# EAGLE design CrowPanel ESP32 Display-3.5-V2.2-20240704 (EAGLE 9.5.1)
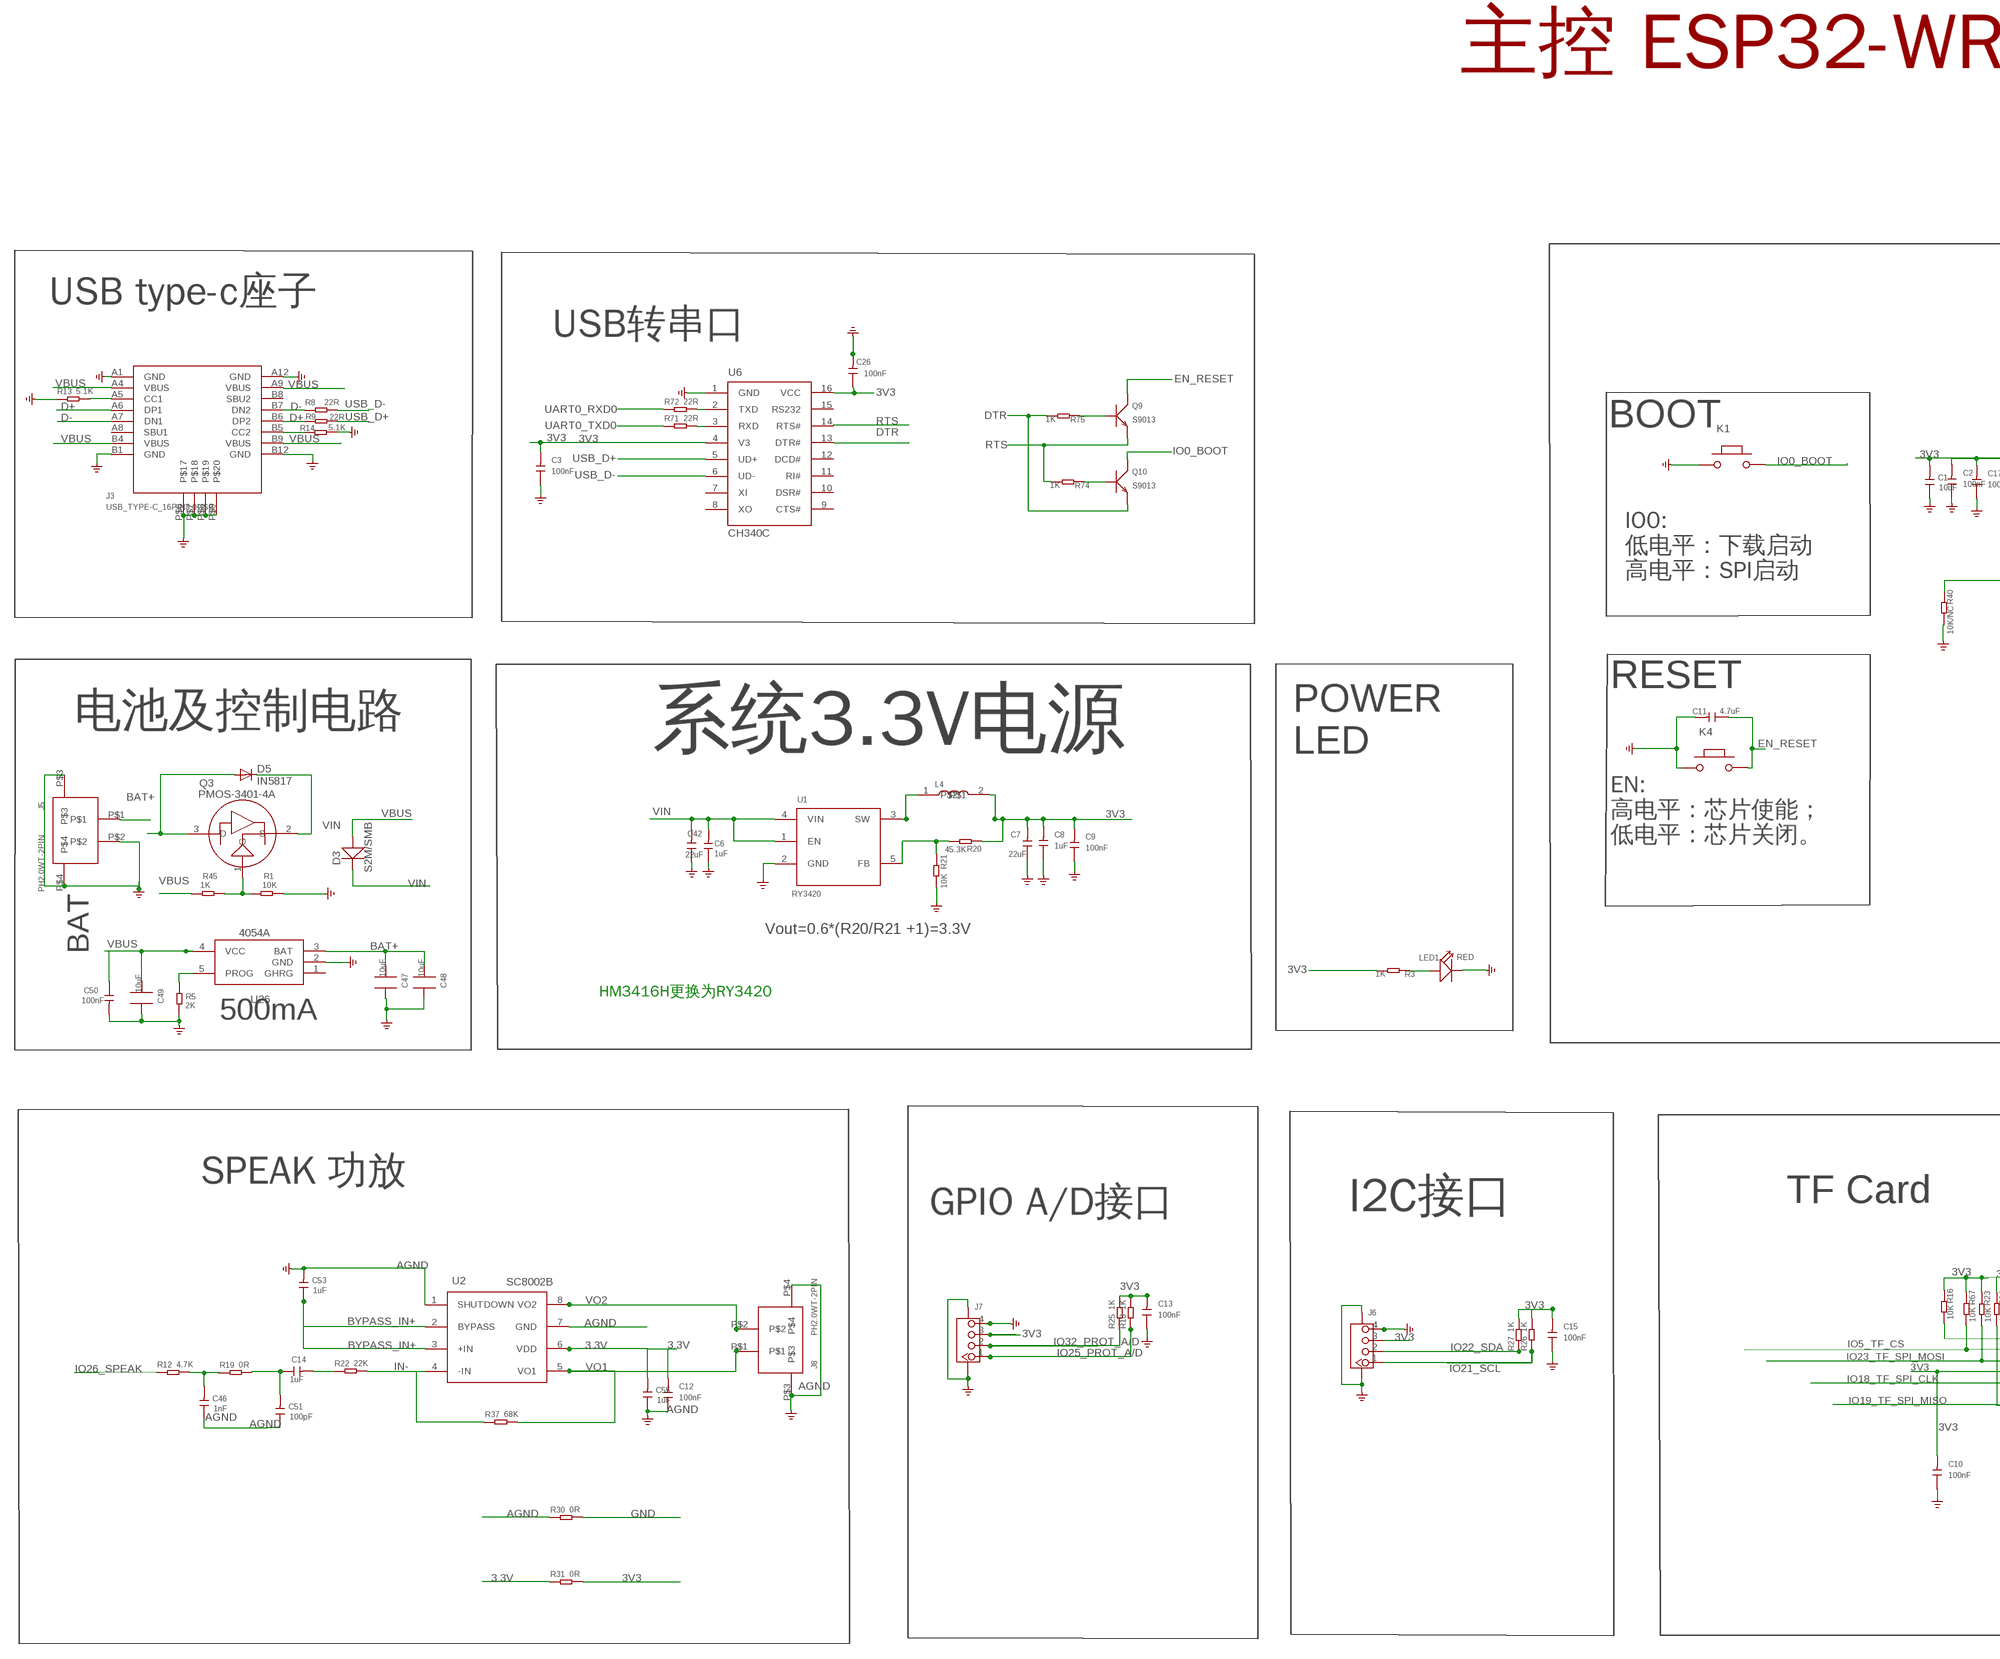
[diagram p0: schematic, sheet 1, part 1 of 2]
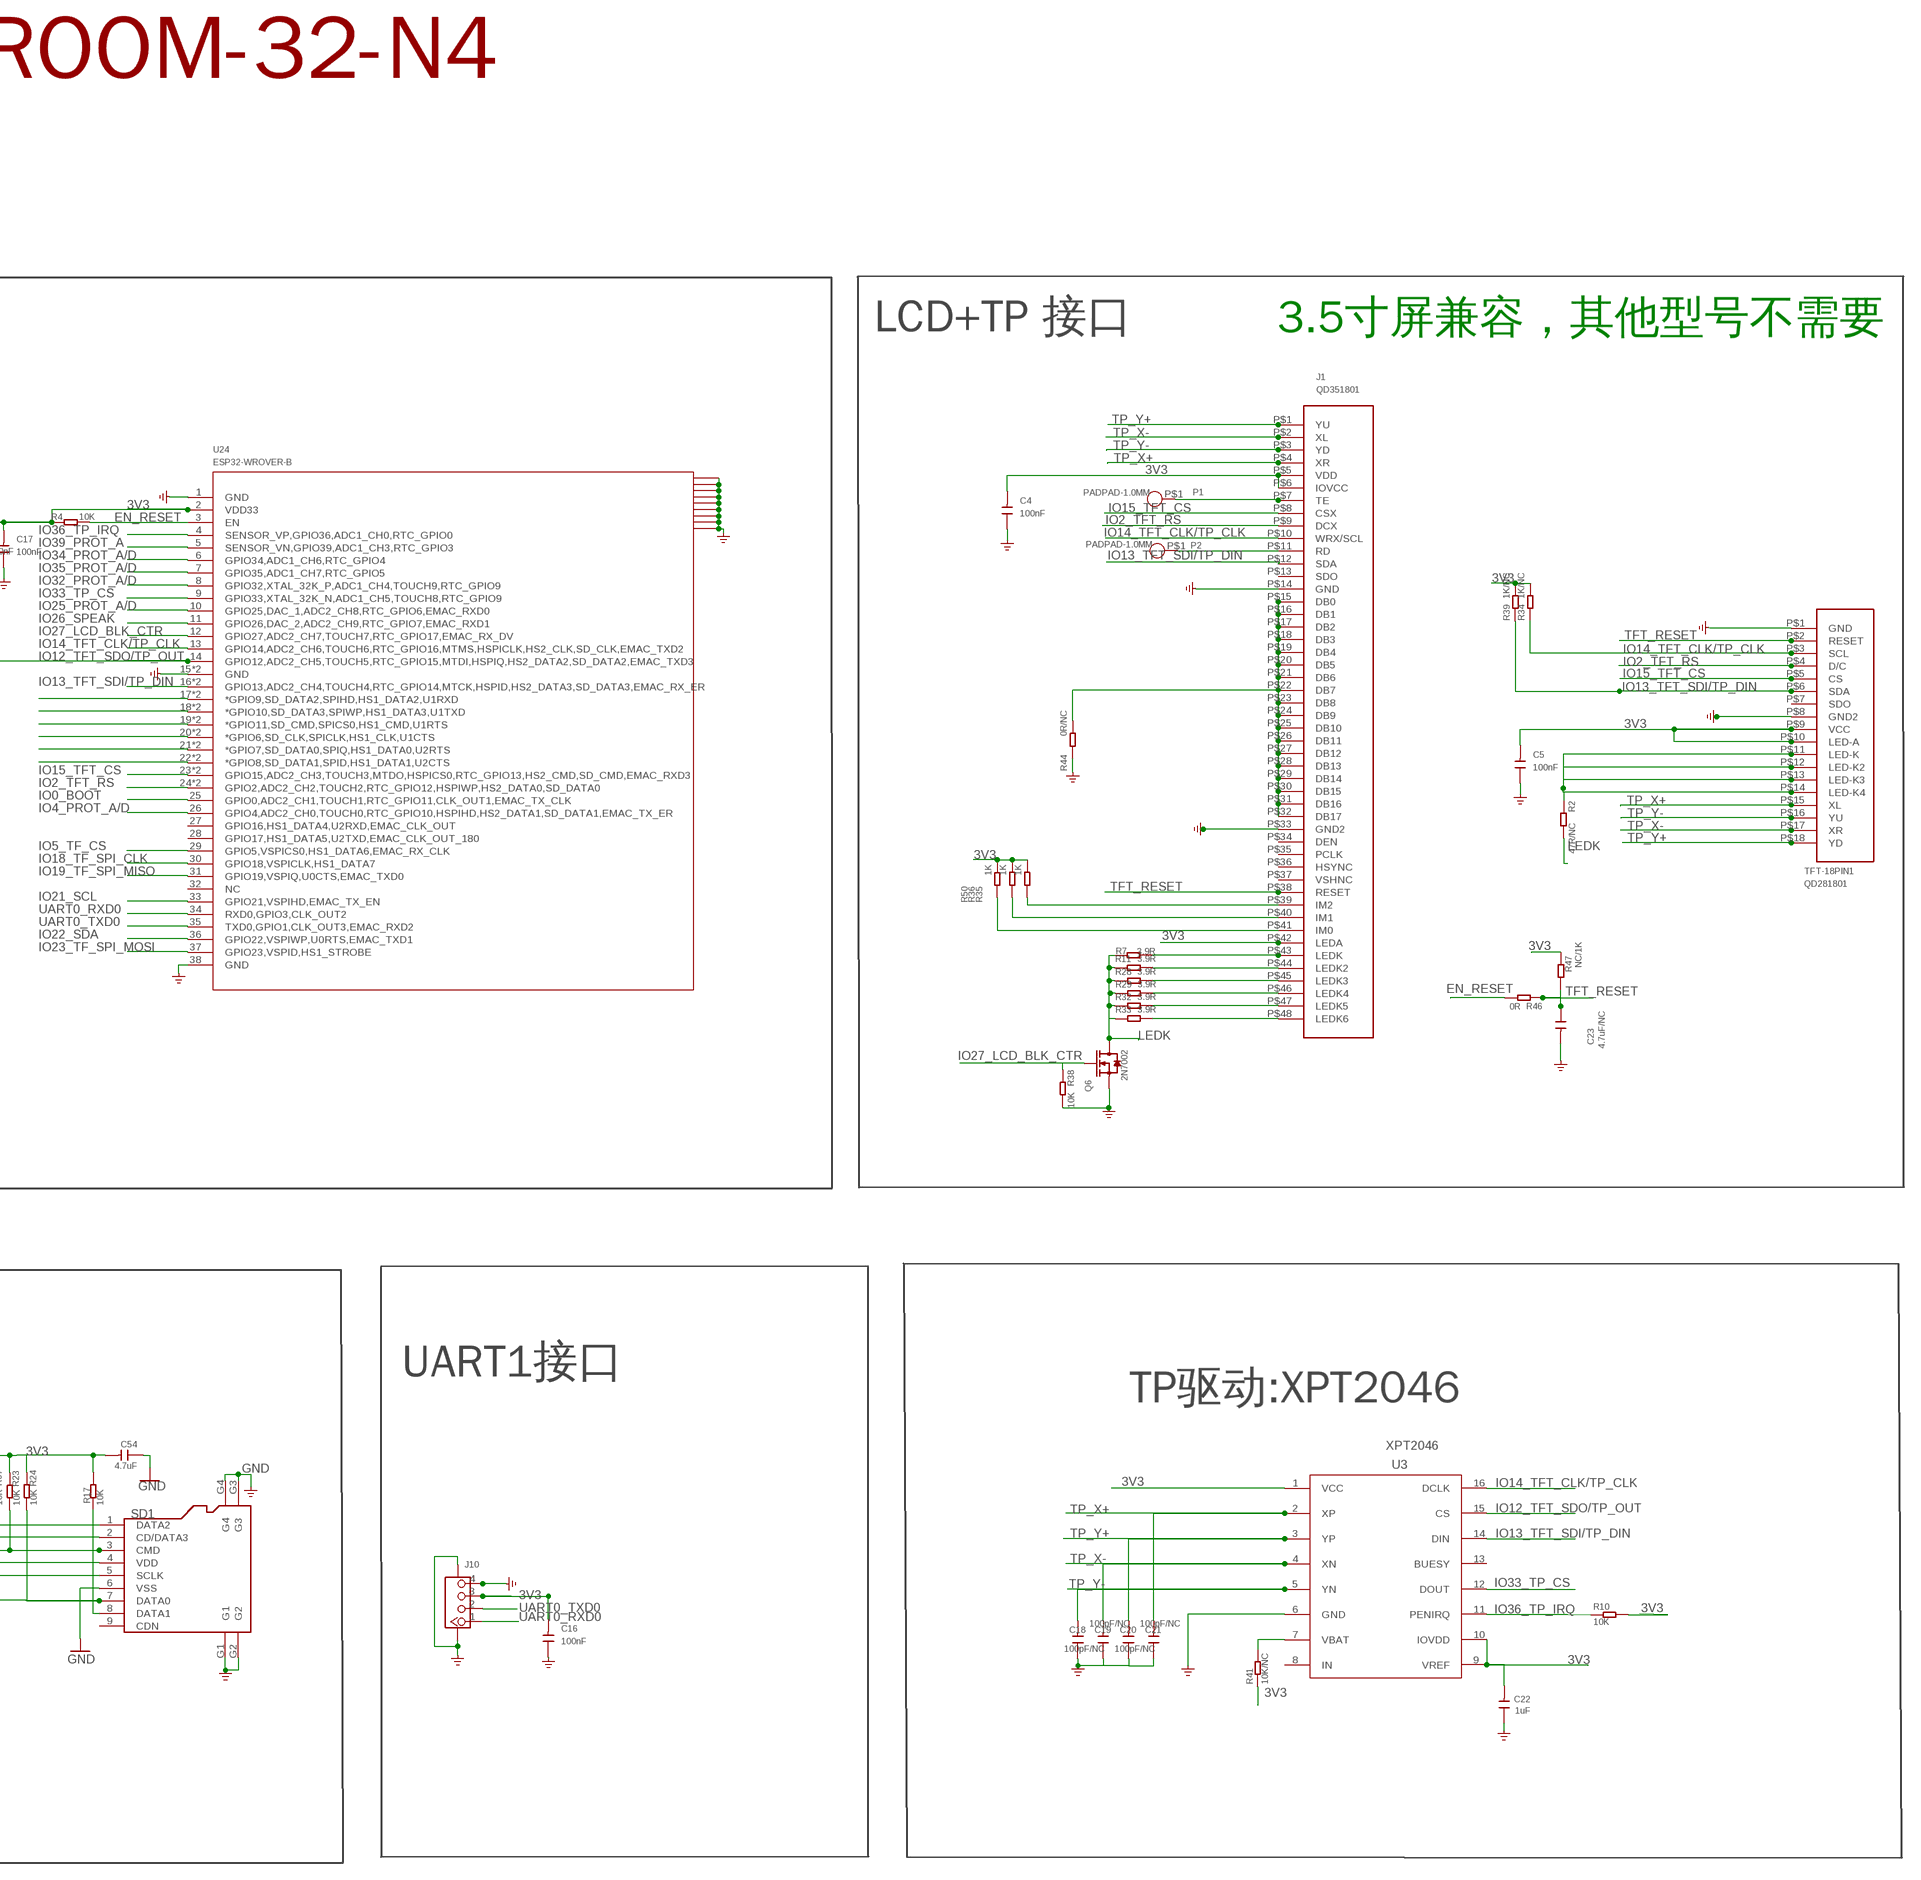
[diagram p1: schematic, sheet 1, part 2 of 2]

## Parts
C1  10uF  DISCRETE_C-0603  [DISCRETE_C0603]
C2  100nF  C0603  [0603]
C3  100nF  C0603  [0603]
C4  100nF  C0603  [0603]
C5  100nF  C0603  [0603]
C6  1uF  C0603  [0603]
C7  22uF  C0805  [0805]
C8  1uF  C0603  [0603]
C9  100nF  C0603  [0603]
C10  100nF  C0603  [0603]
C11  4.7uF  C0603  [0603]
C12  100nF  C0603  [0603]
C13  100nF  C0603  [0603]
C14  1uF  DISCRETE_C-0603  [DISCRETE_C0603]
C15  100nF  C0603  [0603]
C16  100nF  C0603  [0603]
C17  100nF  C0603  [0603]
C18  100pF/NC  C0603  [0603]
C19  100pF/NC  C0603  [0603]
C20  100pF/NC  C0603  [0603]
C21  100pF/NC  C0603  [0603]
C22  1uF  DISCRETE_C-0603  [DISCRETE_C0603]
C23  4.7uF/NC  C0603  [0603]
C26  100nF  C0603  [0603]
C42  22uF  C0805  [0805]
C46  1nF  DISCRETE_C-0603  [DISCRETE_C0603]
C47  10uF  C0805_S  [0805_S]
C48  10uF  C0805_S  [0805_S]
C49  10uF  C0805_S  [0805_S]
C50  100nF  C-0603  [C0603]
C51  100pF  DISCRETE_C-0603  [DISCRETE_C0603]
C53  1uF  DISCRETE_C-0603  [DISCRETE_C0603]
C54  4.7uF  DISCRETE_C-0603  [DISCRETE_C0603]
C55  1uF  DISCRETE_C-0603  [DISCRETE_C0603]
D3  S2M/SMB  214ABDO-214AB  [214AB]
D5  IN5817  DIODE-DO-214AC  [DO-214AC]
J1  QD351801  [QD351801-0.8MM*48]
J3  USB_TYPE-C_16PIN3.0USB  [KEVIN_3.0TYPEC-SMD]
J5  PH2.0WT-2PIN  [PH2.0WT-2PIN]
J6  CONNECTOR_TWIG-4P-2.0-SMD-FEMALE-REINFORCE90D  [CONNECTOR_4P-SMD-2.0-90D]
J7  CONNECTOR_TWIG-4P-2.0-SMD-FEMALE-REINFORCE90D  [CONNECTOR_4P-SMD-2.0-90D]
J8  PH2.0WT-2PIN  [PH2.0WT-2PIN]
J10  CONNECTOR_TWIG-4P-2.0-SMD-FEMALE-REINFORCE90D  [CONNECTOR_4P-SMD-2.0-90D]
K1  BUTTON  PB157  [157SW]
K4  BUTTON  PB157  [157SW]
L4  L-0530  [CD54_CD54]
LED1  RED  DISCRETE_LED0603  [DISCRETE_LED-0603]
P1  PADPAD-1.0MM  [PAD-1.0MM]
P2  PADPAD-1.0MM  [PAD-1.0MM]
Q3  PMOS-3401-4A  P-MOS-SOT23  [SOT-23]
Q6  2N7002  MOSFET-N'SOT23'  [SOT23]
Q9  S9013  TRANSISTOR-NPN-SOT23  [SOT23@1]
Q10  S9013  TRANSISTOR-NPN-SOT23  [SOT23@1]
R1  10K  DISCRETE_R-0603  [DISCRETE_R0603]
R2  47R/NC  DISCRETE_R-0603  [DISCRETE_R0603]
R3  1K  DISCRETE_R-0603  [DISCRETE_R0603]
R4  10K  R0603  [R0603]
R5  2K  DISCRETE_R-0603  [DISCRETE_R0603]
R7  3.9R  DISCRETE_R-0603  [DISCRETE_R0603]
R8  22R  DISCRETE_R-0603  [DISCRETE_R0603]
R9  22R  DISCRETE_R-0603  [DISCRETE_R0603]
R10  10K  DISCRETE_R-0603  [DISCRETE_R0603]
R11  3.9R  DISCRETE_R-0603  [DISCRETE_R0603]
R12  4.7K  DISCRETE_R-0603  [DISCRETE_R0603]
R13  5.1K  DISCRETE_R-0603  [DISCRETE_R0603]
R14  5.1K  DISCRETE_R-0603  [DISCRETE_R0603]
R16  10K  DISCRETE_R-0603  [DISCRETE_R0603]
R17  10K  DISCRETE_R-0603  [DISCRETE_R0603]
R18  1K  DISCRETE_R-0603  [DISCRETE_R0603]
R19  0R  DISCRETE_R-0603  [DISCRETE_R0603]
R20  45.3K  DISCRETE_R-0603  [DISCRETE_R0603]
R21  10K  DISCRETE_R-0603  [DISCRETE_R0603]
R22  22K  DISCRETE_R-0603  [DISCRETE_R0603]
R23  10K  DISCRETE_R-0603  [DISCRETE_R0603]
R24  10K  DISCRETE_R-0603  [DISCRETE_R0603]
R25  1K  DISCRETE_R-0603  [DISCRETE_R0603]
R26  1K  DISCRETE_R-0603  [DISCRETE_R0603]
R27  1K  DISCRETE_R-0603  [DISCRETE_R0603]
R28  3.9R  DISCRETE_R-0603  [DISCRETE_R0603]
R29  3.9R  DISCRETE_R-0603  [DISCRETE_R0603]
R30  0R  DISCRETE_R-0603  [DISCRETE_R0603]
R31  0R  DISCRETE_R-0603  [DISCRETE_R0603]
R32  3.9R  DISCRETE_R-0603  [DISCRETE_R0603]
R33  3.9R  DISCRETE_R-0603  [DISCRETE_R0603]
R34  1K/NC  DISCRETE_R-0603  [DISCRETE_R0603]
R35  1K  DISCRETE_R-0603  [DISCRETE_R0603]
R36  1K  DISCRETE_R-0603  [DISCRETE_R0603]
R37  68K  DISCRETE_R-0603  [DISCRETE_R0603]
R38  10K  DISCRETE_R-0603  [DISCRETE_R0603]
R39  1K/NC  DISCRETE_R-0603  [DISCRETE_R0603]
R40  10K/NC  DISCRETE_R-0603  [DISCRETE_R0603]
R41  10K/NC  DISCRETE_R-0603  [DISCRETE_R0603]
R44  0R/NC  DISCRETE_R-0603  [DISCRETE_R0603]
R45  1K  DISCRETE_R-0603  [DISCRETE_R0603]
R46  0R  DISCRETE_R-0603  [DISCRETE_R0603]
R47  NC/1K  DISCRETE_R-0603  [DISCRETE_R0603]
R50  1K  DISCRETE_R-0603  [DISCRETE_R0603]
R67  10K  DISCRETE_R-0603  [DISCRETE_R0603]
R71  22R  DISCRETE_R-0603  [DISCRETE_R0603]
R72  22R  DISCRETE_R-0603  [DISCRETE_R0603]
R74  1K  DISCRETE_R-0603  [DISCRETE_R0603]
R75  1K  DISCRETE_R-0603  [DISCRETE_R0603]
SD1  HOLDER-MICROSD-9P  [9P-SMD-W/-RING]
TFT-18PIN1  QD281801  [QD241801-18PIN*0.8]
U1  RY3420  A_XBJ_HM3420B  [A_XBJ_SOT23-5]
U2  SC8002B  SC8002BSC8002B-SOP8  [AT24C02_SOP8]
U3  XP2046  [XP2046-SSOP16]
U6  CH340C  CH340G  [SOP-16]
U24  ESP32-WROVER-B  ESP32-WROOM-32-N4  [ESP32-WROOM-32-N4]
U26  4054A  [SOP23-5]

## Nets
3.3V: C12.2 C55.2 R31.1 U2.6(VDD)
3V3: C1.2 C2.2 C3.2 C4.2 C5.2 C7.2 C8.2 C9.2 C10.2 C13.2 C15.2 C16.2 C17.2 C22.2 C26.1 C54.2 J1.P$5(VDD) J1.P$6(IOVCC) J1.P$42(LEDA) J6.3 J7.3 J10.3 L4.2 R3.2 R4.1 R10.2 R16.1 R17.1 R18.2 R20.1 R23.1 R24.1 R25.2 R26.2 R27.2 R31.2 R34.2 R35.2 R36.2 R39.2 R41.1 R47.2 R50.2 R67.1 SD1.4(VDD) TFT-18PIN1.P$9(VCC) TFT-18PIN1.P$10(LED-A) U3.1(VCC) U3.9(VREF) U3.10(IOVDD) U6.4(V3) U6.16(VCC) U24.2(VDD33)
AGND: C12.1 C46.1 C51.1 C53.2 C55.1 J8.P$3 J8.P$4 R30.1 U2.1(SHUTDOWN) U2.7(GND) ; supply symbol labelled GND
BAT+: C47.2 C48.2 D5.A J5.P$1 Q3.3(D) U26.3(BAT)
BYPASS_IN+: C53.1 U2.2(BYPASS) U2.3(+IN)
D+: J3.A6(DP1) J3.B6(DP2) R9.1
D-: J3.A7(DN1) J3.B7(DN2) R8.1
DTR: Q10.2(E) R75.2 U6.13(DTR#)
EN_RESET: C11.1 K4.2 Q9.3(C) R4.2 R46.2 U24.3(EN)
GND: C1.1 C2.1 C3.1 C4.1 C5.1 C6.1 C7.1 C8.1 C9.1 C10.1 C11.2 C13.1 C15.1 C16.1 C17.1 C18.1 C19.1 C20.1 C21.1 C22.1 C23.2 C26.2 C42.1 C47.1 C48.1 C49.1 C50.2 C54.1 J1.P$14(GND) J1.P$33(GND2) J3.A1(GND) J3.A12(GND) J3.B1(GND) J3.B12(GND) J3.P$6 J3.P$7 J3.P$8 J3.P$9 J5.P$2 J5.P$3 J5.P$4 J6.4 J6.SS1 J6.SS2 J7.4 J7.SS1 J7.SS2 J10.4 J10.SS1 J10.SS2 K1.1 K4.1 LED1.- Q6.2(S) R1.1 R5.2 R13.1 R14.2 R21.2 R30.2 R38.2 R40.2 R44.1 SD1.6(VSS) SD1.G1 SD1.G2 SD1.G3 SD1.G4 TFT-18PIN1.P$1(GND) TFT-18PIN1.P$8(GND2) U1.2(GND) U3.6(GND) U6.1(GND) U24.1(GND) U24.15(GND) U24.15@1(GND) U24.38(GND) U24.41(GND) U24.42(GND) U24.43(GND) U24.44(GND) U24.45(GND) U24.46(GND) U24.47(GND) U24.48(GND) U24.49(GND) U26.2(GND)
IN-: R22.2 R37.1 U2.4(-IN)
IO0_BOOT: K1.2 Q10.3(C) U24.25(GPIO0,ADC2_CH1,TOUCH1,RTC_GPIO11,CLK_OUT1,EMAC_TX_CLK)
IO2_TFT_RS: J1.P$9(DCX) TFT-18PIN1.P$4(D/C) U24.24(GPIO2,ADC2_CH2,TOUCH2,RTC_GPIO12,HSPIWP,HS2_DATA0,SD_DATA0) U24.24@1(GPIO2,ADC2_CH2,TOUCH2,RTC_GPIO12,HSPIWP,HS2_DATA0,SD_DATA0)
IO4_PROT_A/D: U24.26(GPIO4,ADC2_CH0,TOUCH0,RTC_GPIO10,HSPIHD,HS2_DATA1,SD_DATA1,EMAC_TX_ER)
IO5_TF_CS: R67.2 SD1.2(CD/DATA3) U24.29(GPIO5,VSPICS0,HS1_DATA6,EMAC_RX_CLK)
IO12_TFT_SDO/TP_OUT: R40.1 U3.15(CS) U24.14(GPIO12,ADC2_CH5,TOUCH5,RTC_GPIO15,MTDI,HSPIQ,HS2_DATA2,SD_DATA2,EMAC_TXD3)
IO13_TFT_SDI/TP_DIN: J1.P$12(SDA) R39.1 TFT-18PIN1.P$6(SDA) U3.14(DIN) U24.16(GPIO13,ADC2_CH4,TOUCH4,RTC_GPIO14,MTCK,HSPID,HS2_DATA3,SD_DATA3,EMAC_RX_ER) U24.16@1(GPIO13,ADC2_CH4,TOUCH4,RTC_GPIO14,MTCK,HSPID,HS2_DATA3,SD_DATA3,EMAC_RX_ER)
IO14_TFT_CLK/TP_CLK: J1.P$10(WRX/SCL) R34.1 TFT-18PIN1.P$3(SCL) U3.16(DCLK) U24.13(GPIO14,ADC2_CH6,TOUCH6,RTC_GPIO16,MTMS,HSPICLK,HS2_CLK,SD_CLK,EMAC_TXD2)
IO15_TFT_CS: J1.P$8(CSX) TFT-18PIN1.P$5(CS) U24.23(GPIO15,ADC2_CH3,TOUCH3,MTDO,HSPICS0,RTC_GPIO13,HS2_CMD,SD_CMD,EMAC_RXD3) U24.23@1(GPIO15,ADC2_CH3,TOUCH3,MTDO,HSPICS0,RTC_GPIO13,HS2_CMD,SD_CMD,EMAC_RXD3)
IO18_TF_SPI_CLK: SD1.5(SCLK) U24.30(GPIO18,VSPICLK,HS1_DATA7)
IO19_TF_SPI_MISO: R24.2 SD1.7(DATA0) U24.31(GPIO19,VSPIQ,U0CTS,EMAC_TXD0)
IO21_SCL: J6.1 R26.1 U24.33(GPIO21,VSPIHD,EMAC_TX_EN)
IO22_SDA: J6.2 R27.1 U24.36(GPIO22,VSPIWP,U0RTS,EMAC_TXD1)
IO23_TF_SPI_MOSI: R23.2 SD1.3(CMD) U24.37(GPIO23,VSPID,HS1_STROBE)
IO25_PROT_A/D: J7.1 R18.1 U24.10(GPIO25,DAC_1,ADC2_CH8,RTC_GPIO6,EMAC_RXD0)
IO26_SPEAK: R12.1 U24.11(GPIO26,DAC_2,ADC2_CH9,RTC_GPIO7,EMAC_RXD1)
IO27_LCD_BLK_CTR: Q6.1(G) R38.1 U24.12(GPIO27,ADC2_CH7,TOUCH7,RTC_GPIO17,EMAC_RX_DV)
IO32_PROT_A/D: J7.2 R25.1 U24.8(GPIO32,XTAL_32K_P,ADC1_CH4,TOUCH9,RTC_GPIO9)
IO33_TP_CS: U3.12(DOUT) U24.9(GPIO33,XTAL_32K_N,ADC1_CH5,TOUCH8,RTC_GPIO9)
IO34_PROT_A/D: U24.6(GPIO34,ADC1_CH6,RTC_GPIO4)
IO35_PROT_A/D: U24.7(GPIO35,ADC1_CH7,RTC_GPIO5)
IO36_TP_IRQ: R10.1 U3.11(PENIRQ) U24.4(SENSOR_VP,GPIO36,ADC1_CH0,RTC_GPIO0)
IO39_PROT_A: U24.5(SENSOR_VN,GPIO39,ADC1_CH3,RTC_GPIO3)
LEDK: Q6.3(D) R2.2 R7.2 R11.1 R28.1 R29.1 R32.1 R33.1
LEDK1: R2.1 TFT-18PIN1.P$11(LED-K) TFT-18PIN1.P$12(LED-K2) TFT-18PIN1.P$13(LED-K3) TFT-18PIN1.P$14(LED-K4)
N$1: LED1.+ R3.1
N$2: Q9.1(B) R75.1
N$3: C46.2 R12.2 R19.1
N$4: R41.2 U3.7(VBAT)
N$5: J1.P$15(DB0) J1.P$16(DB1) J1.P$17(DB2) J1.P$18(DB3) J1.P$19(DB4) J1.P$20(DB5) J1.P$21(DB6) J1.P$22(DB7) J1.P$23(DB8) J1.P$24(DB9) J1.P$25(DB10) J1.P$26(DB11) J1.P$27(DB12) J1.P$28(DB13) J1.P$29(DB14) J1.P$30(DB15) J1.P$31(DB16) J1.P$32(DB17) R44.2
N$6: J3.B5(CC2) R14.1
N$7: J3.A5(CC1) R13.2
N$8: J1.P$44(LEDK2) R11.2
N$9: J1.P$11(RD) P2.P$1
N$10: U24.17(*GPIO9,SD_DATA2,SPIHD,HS1_DATA2,U1RXD) U24.17@1(*GPIO9,SD_DATA2,SPIHD,HS1_DATA2,U1RXD)
N$11: U24.18(*GPIO10,SD_DATA3,SPIWP,HS1_DATA3,U1TXD) U24.18@1(*GPIO10,SD_DATA3,SPIWP,HS1_DATA3,U1TXD)
N$12: J1.P$43(LEDK) R7.1
N$13: L4.1 U1.3(SW)
N$14: J1.P$39(IM2) R35.1
N$15: U24.19(*GPIO11,SD_CMD,SPICS0,HS1_CMD,U1RTS) U24.19@1(*GPIO11,SD_CMD,SPICS0,HS1_CMD,U1RTS)
N$16: J1.P$40(IM1) R36.1
N$17: J1.P$41(IM0) R50.1
N$18: J1.P$7(TE) P1.P$1
N$19: U24.20(*GPIO6,SD_CLK,SPICLK,HS1_CLK,U1CTS) U24.20@1(*GPIO6,SD_CLK,SPICLK,HS1_CLK,U1CTS)
N$20: R20.2 R21.1 U1.5(FB)
N$21: Q3.1(G) R1.2 R45.1
N$22: R5.1 U26.5(PROG)
N$23: U24.21(*GPIO7,SD_DATA0,SPIQ,HS1_DATA0,U2RTS) U24.21@1(*GPIO7,SD_DATA0,SPIQ,HS1_DATA0,U2RTS)
N$24: U24.22(*GPIO8,SD_DATA1,SPID,HS1_DATA1,U2CTS) U24.22@1(*GPIO8,SD_DATA1,SPID,HS1_DATA1,U2CTS)
N$26: C14.1 C51.2 R19.2
N$29: C14.2 R22.1
N$32: J1.P$45(LEDK3) R28.2
N$33: J1.P$46(LEDK4) R29.2
N$34: J1.P$47(LEDK5) R32.2
N$35: J1.P$48(LEDK6) R33.2
N$38: Q10.1(B) R74.1
N$40: R72.2 U6.2(TXD)
N$42: R71.2 U6.3(RXD)
N$47: R16.2 SD1.1(DATA2)
N$48: R17.2 SD1.8(DATA1)
RTS: Q9.2(E) R74.2 U6.14(RTS#)
TFT_RESET: C23.1 J1.P$38(RESET) R46.1 R47.1 TFT-18PIN1.P$2(RESET)
TP_X+: C21.2 J1.P$4(XR) TFT-18PIN1.P$15(XL) U3.2(XP)
TP_X-: C19.2 J1.P$2(XL) TFT-18PIN1.P$17(XR) U3.4(XN)
TP_Y+: C20.2 J1.P$1(YU) TFT-18PIN1.P$18(YD) U3.3(YP)
TP_Y-: C18.2 J1.P$3(YD) TFT-18PIN1.P$16(YU) U3.5(YN)
UART0_RXD0: J10.1 R72.1 U24.34(RXD0,GPIO3,CLK_OUT2)
UART0_TXD0: J10.2 R71.1 U24.35(TXD0,GPIO1,CLK_OUT3,EMAC_RXD2)
USB_D+: R9.2 U6.5(UD+)
USB_D-: R8.2 U6.6(UD-)
VBUS: C49.2 C50.1 D3.1(+) J3.A4(VBUS) J3.A9(VBUS) J3.B4(VBUS) J3.B9(VBUS) R45.2 U26.4(VCC)
VIN: C6.2 C42.2 D3.2(-) D5.C Q3.2(S) U1.1(EN) U1.4(VIN)
VO1: J8.P$1 R37.2 U2.5(VO1)
VO2: J8.P$2 U2.8(VO2)
Unconnected: J1.P$13(SDO) J1.P$34(DEN) J1.P$35(PCLK) J1.P$36(HSYNC) J1.P$37(VSHNC) J3.A8(SBU1) J3.B8(SBU2) SD1.9(CDN) TFT-18PIN1.P$7(SDO) U3.8(IN) U3.13(BUESY) U6.7(XI) U6.8(XO) U6.9(CTS#) U6.10(DSR#) U6.11(RI#) U6.12(DCD#) U6.15(RS232) U24.27(GPIO16,HS1_DATA4,U2RXD,EMAC_CLK_OUT) U24.28(GPIO17,HS1_DATA5,U2TXD,EMAC_CLK_OUT_180) U24.32(NC) U26.1(GHRG)

## Notes on the sheet
- 主控 ESP32-WROOM-32-N4
- LCD+TP 接口 | 3.5寸屏兼容，其他型号不需要
- USB type-c座子
- USB转串口
- BOOT
- IO0:
  低电平：下载启动
  高电平：SPI启动
- RESET
- 电池及控制电路
- 系统3.3V电源
- POWER
  LED
- EN:
  高电平：芯片使能；
  低电平：芯片关闭。
- Vout=0.6*(R20/R21 +1)=3.3V
- BAT
- HM3416H更换为RY3420
- 500mA
- SPEAK 功放
- I2C接口 | TF Card | UART1接口
- TP驱动:XPT2046
- GPIO A/D接口

## Library data of the parts
C1 C14 C22 C46 C51 C53 C55 = A_xbj:DISCRETE_C*: Ceramic Capacitors
C2-C6 C8-C13 C15-C21 C23 C26 = A_xbj:C0603
C7 C42 = A_xbj:C0805
C47-C49 = CPT_SMD:C0805
C50 = discrete:C*: Ceramic Capacitors
C54 = A9G:DISCRETE_C*: Ceramic Capacitors
D3 = DO-214AB:214AB: 214AB
D5 = diode:DIODE-: DIODE
J1 = cooper:QD351801
J3 = WZ3532R024-ESP32-V0.1-20221226:USB_TYPE-C_16PIN
J5 J8 = cooper:PH2.0WT-2PIN
J6 J7 J10 = A_xbj:CONNECTOR_TWIG-4P-2.0-SMD-FEMALE-REINFORCE
K1 K4 = MySMD:PB157
L4 = WZ2432R028-ESP32-V1.2-20231108:L-0530
LED1 = A_xbj:DISCRETE_LED*
P1 P2 = crowpi_pow:PAD*
Q3 = DFN8:P-MOS-SOT23
Q6 = discrete:MOSFET-N: IRLL014: http://www.vishay.com/docs/91319/sihll014.pdf
Q9 Q10 = discrete:TRANSISTOR-NPN*: NPN audion
R1 R5 R10 R41 R45 = A9G:DISCRETE_R*
R2 R3 R7-R9 R11-R14 R16-R40 R44 R46 R47 R50 R67 R71 R72 R74 R75 = Crowtail-_LED-V2.0-20190615-01:DISCRETE_R*
R4 = A_xbj:R0603
SD1 = Connector:HOLDER-MICROSD-9P
TFT-18PIN1 = cooper:QD281801
U1 = CrowBot_-V1.0-20220525:A_XBJ_HM3420B
U2 = cooper:SC8002B
U3 = cooper:XP2046; XPT2046: XPT2046
U6 = A_xbj:CH340G
U24 = cooper:ESP32-WROOM-32-N4
U26 = DFN8:4054A

## Net classes
0 default: width 0.152 mm, drill 0.305 mm, clearance 0.203 mm

## Board
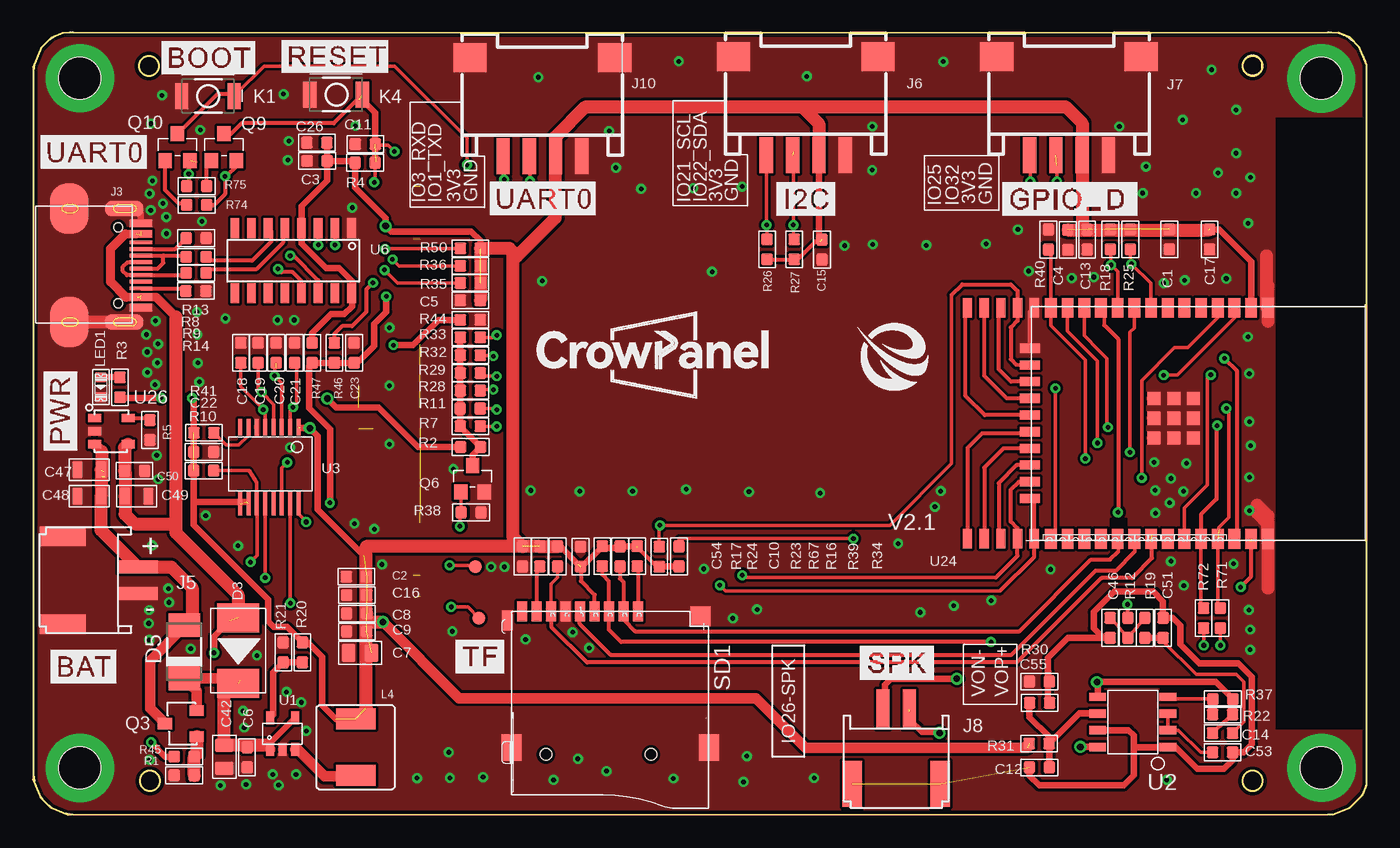
[diagram p2: board, top side]
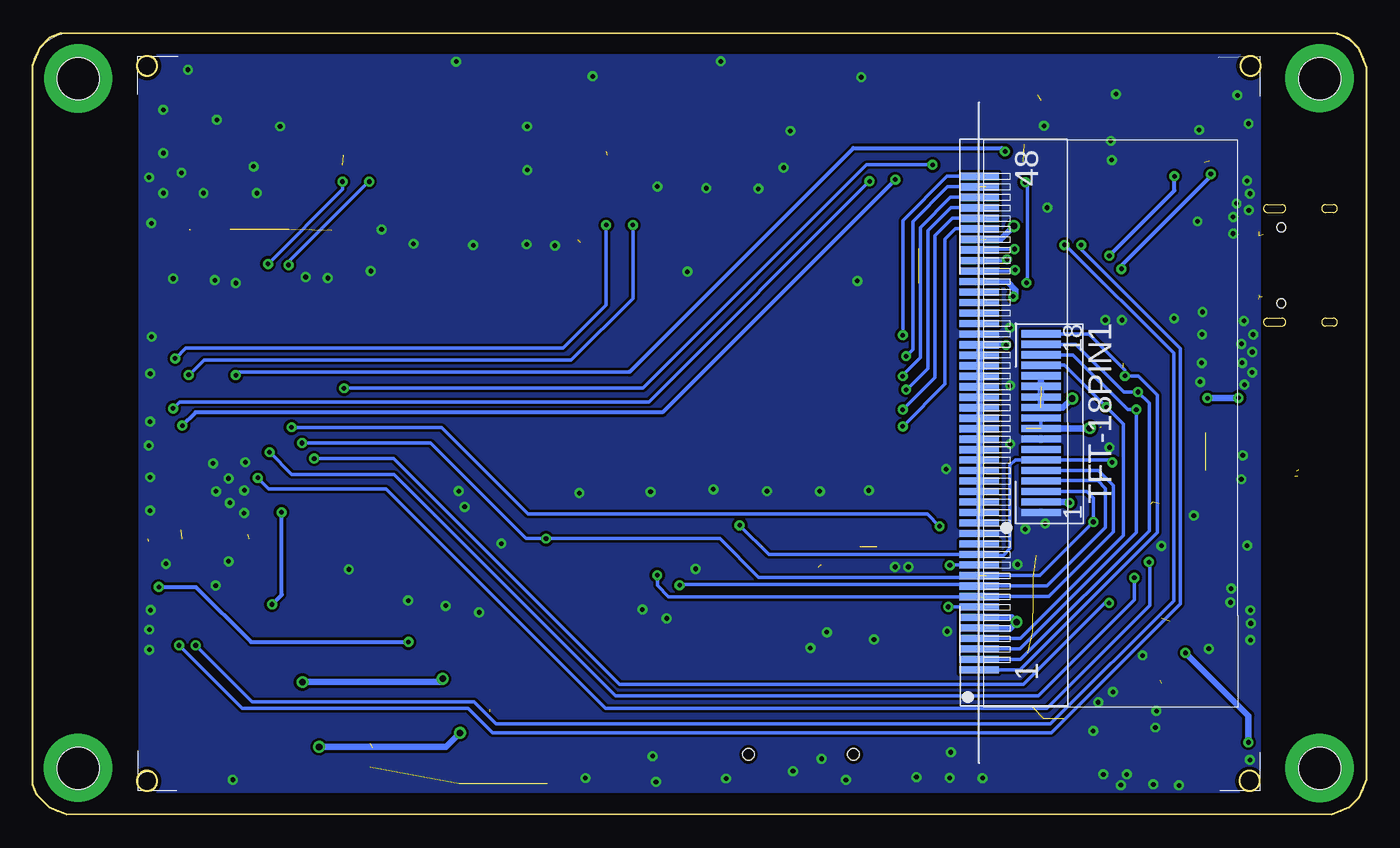
[diagram p3: board, bottom side, seen from below]

Size 101.5 x 59.52 mm. Coordinates in mm from the lower left corner, seen from the top.
Outline: 101.5,2.28 101.5,57.07 100.93,58.44 100.2,59.17 99.35,59.52 2.24,59.5 1.36,59.14 0.6,58.38 0,56.92 0,2.67 0.57,1.29 1.3,0.56 2.66,0 98.95,0.02 100.19,0.54 101.19,1.53 101.5,2.28
Outline: circle at 92.81,2.57 radius 0.75
Outline: circle at 92.81,57.01 radius 0.75
Outline: circle at 8.81,57.01 radius 0.75
Outline: circle at 8.89,2.57 radius 0.75
Copper layers (1*16): Top 0.035mm / dielectric 1.5mm / Bottom 0.035mm
Design rules "default *": minimum track width 6mil, minimum drill 0.35mm, track to track 6mil, track to pad 5mil, pad to pad 5mil, via to via 6mil, smd to smd 6mil, copper to edge 10mil, drill to drill 10mil, minimum pad ring 10mil, minimum via ring 8mil, stop-mask expansion 4mil, vias tented up to drill 100mil, thermal gap 0mil
tRestrict: area 21.1,135.9 to 30.9,154.9
bRestrict: area 21.1,135.9 to 30.9,154.9

### Footprints (pad centres in the part's own frame; a part is rotated, then mirrored left to right if it is on the bottom)
DISCRETE_C0603 = smd 0.889 x 0.889: 1 -0.762,0; 2 0.762,0
0603 = smd 0.889 x 0.889: 1 -0.762,0; 2 0.762,0
0805 = smd 1.016 x 1.397: 1 -0.889,0; 2 0.889,0
0805_S = smd 0.762 x 1.27: 1 -0.889,0; 2 0.889,0
C0603 = smd 0.889 x 0.889: 1 -0.762,0; 2 0.762,0
214AB = smd 2.2 x 3.2: 1 -2.5,0; 2 2.5,0
DO-214AC = smd 1.8 x 2.4: A 2.025,0; C -2.025,0
QD351801-0.8MM*48 = smd 0.55 x 3: P$1 0,0.508; P$2 0.8,0.508; P$3 1.6,0.508; P$4 2.4,0.508; P$5 3.2,0.508; P$6 4,0.508; P$7 4.8,0.508; P$8 5.588,0.508; P$9 6.388,0.508; P$10 7.188,0.508; P$11 7.988,0.508; P$12 8.788,0.508; P$13 9.588,0.508; P$14 10.388,0.508; P$15 11.188,0.508; P$16 11.988,0.508; P$17 12.788,0.508; P$18 13.589,0.508; P$19 14.389,0.508; P$20 15.189,0.508; P$21 15.989,0.508; P$22 16.764,0.508; P$23 17.564,0.508; P$24 18.364,0.508; P$25 19.164,0.508; P$26 19.964,0.508; P$27 20.764,0.508; P$28 21.564,0.508; P$29 22.364,0.508; P$30 23.164,0.508; P$31 23.964,0.508; P$32 24.764,0.508; P$33 25.564,0.508; P$34 26.364,0.508; P$35 27.164,0.508; P$36 27.964,0.508; P$37 28.764,0.508; P$38 29.564,0.508; P$39 30.364,0.508; P$40 31.164,0.508; P$41 31.98,0.498; P$42 32.78,0.498; P$43 33.58,0.498; P$44 34.38,0.498; P$45 35.18,0.498; P$46 35.98,0.498; P$47 36.78,0.498; P$48 37.58,0.498
KEVIN_3.0TYPEC-SMD = smd 0.3 x 1.7: A1 -3.35,0.5; A4 -2.55,0.5; A5 -1.25,0.5; A6 -0.25,0.5; A7 0.25,0.5; A8 1.25,0.5; A9 2.55,0.5; A12 3.35,0.5; B1 3.05,0.5; B4 2.25,0.5; B5 1.75,0.5; B6 0.75,0.5; B7 -0.75,0.5; B8 -1.75,0.5; B9 -2.25,0.5; B12 -3.05,0.5 | smd 1.143 x 2.921: P$6 -4.318,-0.762; P$7 4.318,-0.762 | smd 3.81 x 2.921: P$8 -4.318,-4.953; P$9 4.318,-4.953 | hole 0.68: -2.89,-1.22; 2.89,-1.22
PH2.0WT-2PIN = smd 1 x 3: P$1 -1,0; P$2 1,0 | smd 1.5 x 3.5: P$3 -3.35,-5.7; P$4 3.35,-5.7
CONNECTOR_4P-SMD-2.0-90D = smd 1.01 x 2.74: 1 -3,-0.1; 2 -1,-0.1; 3 1,-0.1; 4 3,-0.1 | smd 2.54 x 2.184: SS1 -5.5,7.4; SS2 5.5,7.4
157SW = smd 1.016 x 1.981: 1 0,0; 2 4,0
CD54_CD54 = smd 3 x 1.6: 1 0,2.159; 2 0,-2.159
DISCRETE_LED-0603 = smd 0.762 x 0.889: + -0.762,0; - 0.762,0
PAD-1.0MM = smd 1 x 1: P$1 0,0
SOT-23 = smd 1.1 x 0.8: 1 1.2,-1; 2 1.2,1 | smd 1.1 x 0.9: 3 -1.2,0
SOT23 = smd 1.016 x 1.143: 1 -0.889,-1.016; 2 0.889,-1.016; 3 0,1.016
SOT23@1 = smd 1.016 x 1.143: 1 -0.95,-1.016; 2 0.95,-1.016; 3 0,1.016
DISCRETE_R0603 = smd 0.889 x 0.889: 1 -0.762,0; 2 0.762,0
R0603 = smd 0.889 x 0.889: 1 -0.762,0; 2 0.762,0
9P-SMD-W/-RING = smd 1.524 x 0.762: 1 0,4.4; 2 0,3.3; 3 0,2.2; 4 0,1.1; 5 0,0; 6 0,-1.1; 7 0,-2.2; 8 0,-3.3; 9 0,-4.4 | smd 1.524 x 0.8: G1 0.7,-5.546 | smd 2.032 x 1.524: G2 10.373,-5.2; G3 10.373,9.8 | smd 1.524 x 1.524: G4 0.392,9.181 | hole 0.889: 10.9,-2.6; 10.9,5.4
QD241801-18PIN*0.8 = smd 0.55 x 3: P$1 -6.789,-1.538; P$2 -5.989,-1.538; P$3 -5.189,-1.538; P$4 -4.389,-1.538; P$5 -3.589,-1.538; P$6 -2.789,-1.538; P$7 -1.989,-1.538; P$8 -1.189,-1.538; P$9 -0.389,-1.538; P$10 0.411,-1.538; P$11 1.211,-1.538; P$12 2.011,-1.538; P$13 2.811,-1.538; P$14 3.611,-1.538; P$15 4.411,-1.538; P$16 5.211,-1.538; P$17 6.011,-1.538; P$18 6.811,-1.538
A_XBJ_SOT23-5 = smd 0.6 x 1: 1 -0.95,-1.2; 2 0,-1.2; 3 0.95,-1.2; 4 0.95,1.2; 5 -0.95,1.2
AT24C02_SOP8 = smd 0.635 x 1.27: 1 -1.905,-2.667; 2 -0.635,-2.667; 3 0.635,-2.667; 4 1.905,-2.667; 5 1.905,2.667; 6 0.635,2.667; 7 -0.635,2.667; 8 -1.905,2.667
XP2046-SSOP16 = smd 0.305 x 1.27: 1 -2.54,-2.54; 2 -1.905,-2.54; 3 -1.27,-2.54; 4 -0.635,-2.54; 5 0,-2.54; 6 0.635,-2.54; 7 1.27,-2.54; 8 1.905,-2.54 | smd 0.305 x 1.778: 9 1.905,3.302; 10 1.27,3.302; 11 0.635,3.302; 12 0,3.302; 13 -0.635,3.302; 14 -1.27,3.302; 15 -1.905,3.302; 16 -2.54,3.302
SOP-16 = smd 0.66 x 1.5: 1 -4.445,-2.475; 2 -3.175,-2.475; 3 -1.905,-2.475; 4 -0.635,-2.475; 5 0.635,-2.475; 6 1.905,-2.475; 7 3.175,-2.475; 8 4.445,-2.475; 9 4.445,2.475; 10 3.175,2.475; 11 1.905,2.475; 12 0.635,2.475; 13 -0.635,2.475; 14 -1.905,2.475; 15 -3.175,2.475; 16 -4.445,2.475
ESP32-WROOM-32-N4 = smd 1.5 x 0.9: 1 -8.898,6.761; 2 -8.898,5.491; 3 -8.898,4.221; 4 -8.898,2.951; 5 -8.898,1.681; 6 -8.898,0.411; 7 -8.898,-0.859; 8 -8.898,-2.129; 9 -8.898,-3.399; 10 -8.898,-4.669; 11 -8.898,-5.939; 12 -8.898,-7.209; 13 -8.898,-8.479; 14 -8.898,-9.749; 25 8.702,-9.749; 26 8.702,-8.479; 27 8.702,-7.209; 28 8.702,-5.939; 29 8.702,-4.669; 30 8.702,-3.399; 31 8.702,-2.129; 32 8.702,-0.859; 33 8.702,0.411; 34 8.702,1.681; 35 8.702,2.951; 36 8.702,4.221; 37 8.702,5.491; 38 8.702,6.761 | smd 0.7 x 1.5: 15 -5.808,-11.349; 16 -4.538,-11.349; 17 -3.268,-11.349; 18 -1.998,-11.349; 19 -0.728,-11.349; 20 0.542,-11.349; 21 1.812,-11.349; 22 3.082,-11.349; 23 4.352,-11.349; 24 5.622,-11.349 | smd 1.5 x 0.7: 15@1 -8.898,-11.019; 16@1 -8.898,-12.285; 17@1 -8.898,-13.555; 18@1 -8.898,-14.825; 19@1 -8.898,-16.095; 20@1 8.682,-16.095; 21@1 8.682,-14.825; 22@1 8.682,-13.555; 23@1 8.682,-12.285; 24@1 8.682,-11.019 | smd 1 x 1: 41 -0.484,-0.402; 42 1.016,-0.402; 43 -1.984,-0.402; 44 -1.984,-1.902; 45 -0.484,-1.902; 46 1.016,-1.902; 47 1.016,1.098; 48 -0.484,1.098; 49 -1.984,1.098
SOP23-5 = smd 1 x 0.635: 1 -1.27,1; 2 -1.27,0; 3 -1.27,-1; 4 1.27,-1; 5 1.27,1

### Placement (x,y rotation side)
C1  86.48,43.8 90 top
C2  24.6,18.11 0 top
C3  21.61,49.77 0 top
C4  78.76,43.76 90 top
C5  33.27,39.16 0 top
C6  16.28,4.36 90 top
C7  24.88,12.32 0 top
C8  24.63,15.32 0 top
C9  24.63,13.95 0 top
C10  41.67,19.65 270 top
C11  25.28,51.05 180 top
C12  76.59,3.6 0 top
C13  80.23,43.78 90 top
C14  90.53,6.22 180 top
C15  60.03,43.02 90 top
C16  24.63,16.72 0 top
C17  89.53,43.8 90 top
C18  15.8,35.17 270 top
C19  17.13,35.17 270 top
C20  18.5,35.17 270 top
C21  19.89,35.17 270 top
C22  12.98,27.61 180 top
C23  24.43,35.17 90 top
C26  21.6,51.17 180 top
C42  14.55,4.41 90 top
C46  81.97,14.22 90 top
C47  4.27,26.26 0 top
C48  4.27,24.25 0 top
C49  7.89,24.25 180 top
C50  7.72,26.18 0 top
C51  86,14.22 270 top
C53  90.53,4.75 0 top
C54  37.25,19.66 90 top
C55  76.61,8.52 180 top
D3  15.6,12.49 270 top
D5  11.5,12.4 90 top
J1  28.96,11.02 90 bottom
J3  7.7,41.82 270 top
J5  7.96,17.85 270 top
J6  58.8,50.3 0 top
J7  78.84,50.3 0 top
J8  65.69,8.04 0 top
J10  38.76,50.23 0 top
K1  11.3,54.72 0 top
K4  21.05,54.82 0 top
L4  24.55,5.14 180 top
LED1  5.15,32.55 270 top
P1  33.91,14.96 0 top
P2  33.66,18.89 0 top
Q3  11.25,6.94 0 top
Q6  33.44,25.58 0 top
Q9  14.52,50.82 0 top
Q10  10.99,50.82 0 top
R1  11.5,2.99 0 top
R2  33.29,28 0 top
R3  6.6,32.55 270 top
R4  25.26,49.64 0 top
R5  8.89,29.29 270 top
R7  33.28,29.57 180 top
R8  12.41,42.48 0 top
R9  12.41,41.26 0 top
R10  12.98,26.2 180 top
R11  33.26,30.93 0 top
R12  83.31,14.22 270 top
R13  12.41,43.9 180 top
R14  12.38,39.87 0 top
R16  45.98,19.68 270 top
R17  38.56,19.66 270 top
R18  81.99,43.8 90 top
R19  84.61,14.22 270 top
R20  20.5,12.36 270 top
R21  19.03,12.36 90 top
R22  90.53,7.64 180 top
R23  43.32,19.68 270 top
R24  39.91,19.66 270 top
R25  83.51,43.8 90 top
R26  55.86,43.04 270 top
R27  57.93,43.04 270 top
R28  33.27,32.3 0 top
R29  33.27,33.62 0 top
R30  76.59,10.14 180 top
R31  76.57,5.42 180 top
R32  33.27,34.97 0 top
R33  33.27,36.34 0 top
R34  49.15,19.66 270 top
R35  33.27,40.48 0 top
R36  33.27,41.78 0 top
R37  90.54,8.81 0 top
R38  33.32,23.02 0 top
R39  47.65,19.65 270 top
R40  77.28,43.78 90 top
R41  12.99,29.08 0 top
R44  33.27,37.67 180 top
R45  11.5,4.42 180 top
R46  22.92,35.17 90 top
R47  21.24,35.17 90 top
R50  33.27,43.11 0 top
R67  44.67,19.66 270 top
R71  90.35,14.96 270 top
R72  89.09,14.96 270 top
R74  12.44,46.42 0 top
R75  12.44,47.85 180 top
SD1  41.63,15.48 270 top
TFT-18PIN1  26.29,29.8 90 bottom
U1  18.98,6.16 0 top
U2  83.69,7.07 90 top
U3  17.66,26.97 180 top
U6  19.79,42.18 180 top
U24  87.21,29.7 270 top
U26  5.95,29.2 0 top
U$2  [3.5底板框]  -0.6,-0.62 0 top
U$3  [LOGE-2.0]  37.87,31.04 0 top
U$30  [ELECROW-NEW]  62.7,32.27 0 top

### Tracks (layer width: path | path; a pad name or v marks a point on that pad's centre or on a via)
0
  cutout Top: 81.99,22.54 83.26,22.54 83.26,21.78 81.99,21.78
  cutout Top: 38.56,19.24 39.83,19.24 39.83,18.48 38.56,18.48
  cutout Top: 15.95,34.73 17.22,34.73 17.22,33.97 15.95,33.97
  cutout Top: 17.22,34.73 18.49,34.73 18.49,33.97 17.22,33.97
  cutout Top: 18.49,34.73 19.76,34.73 19.76,33.97 18.49,33.97
  cutout Top: 81.99,43.37 83.26,43.37 83.26,42.61 81.99,42.61
  cutout Top: 85.8,10.1 87.07,10.1 87.07,9.33 85.8,9.33
  cutout Top: 90.88,5.78 92.15,5.78 92.15,5.02 90.88,5.02
3.3V
  Top 0.254: 80.72,7.7 U2.6
  Top 0.5: R31.1 77.33,5.93 75.84,7.42 C55.2 | R31.1 79.61,7.7 80.72,7.7 | R31.1 77.35,5.41 C12.2
3V3  (via drill 0.35, 0.5)  (28 unrouted)
  Top 0.254: 79.84,44.64 79.96,44.52
  Top 0.3: R23.1 43.56,20.2 | 41.68,18.81 41.68,17.8 42.73,16.75 SD1.4 | 47.45,18.89 45.97,20.37 | R26.2 R27.2 58.18,42.28 59.54,43.64 59.8,43.64 | U6.16 24.23,39.94 24.33,40.04
  Top 0.5: R67.1 44.67,20.32 43.44,20.32 R23.1 41.77,18.88 C10.2 | R67.1 44.64,20.45 | 42.82,15.39 SD1.4 | 23.02,7.3 22,8.32 22,12.02 20.9,13.12 R20.1 19.32,14.3 18.31,14.3 17.89,14.72 17.89,16.4 12.23,22.06 12.23,23.81 | v9.73,31.73 6.95,31.73 6.9,31.78 R3.2 | R16.1 44.69,20.44 R67.1 | J6.3 59.8,49.92 59.8,43.64 59.86,43.57 | 39.76,48.87 39.76,50.03 J10.3 39.76,51.24 39.76,51.6 | R31.2 75.56,5.42 | 12.23,23.81 R41.1 | 12.23,23.81 16.24,23.81 | 41.49,19.07 40.13,20.42 R24.1 | 47.45,18.89 R39.2 49.14,18.89 R34.2 | 20.28,29.43 v21.05,29.43 21.64,28.84 21.64,23.26 25.15,19.74 | v12.09,31.71 12.22,31.71 C22.2 | 89.56,44.54 90.29,44.54 92.7,42.13 U24.2 | R50.2 34.04,43.7 33.34,44.39 27.24,44.39 v26.82,44.81 26.82,45.41 24.5,47.74 R4.1 24.37,49.77 C3.2 | C3.2 22.36,49.79 C26.1 | C3.2 22.38,48.27 20.42,46.32 U6.4 20.42,43.47 22.29,41.6 23.3,41.6 24.33,40.58 24.33,40.04 | R47.2 21.24,36.68 22.67,38.11 23.68,38.11 24.27,38.69 24.27,39.68 U6.16
  Top 0.8: v26.62,14.67 32.41,8.87 55.01,8.87 58.79,5.09 75.67,5.09
  Top 1: 25.35,15.32 C8.2 | 25.36,8.12 25.35,14.67 | 25.35,14.67 25.35,15.32 | 25.35,15.32 | 39.76,51.6 42.04,53.89 58.52,53.89 | 58.52,53.89 59.8,52.6 59.8,49.92 | 25.35,15.32 25.35,20.42 R17.1 R24.1 | 25.35,14.67 v26.62,14.67 | 39.76,51.24 39.76,50.03 39.76,45.45 36.82,42.52 36.5,42.84 | 58.52,53.89 78.59,53.89 79.84,52.63 J7.3 79.84,44.64 | C4.2 79.96,44.52 89.49,44.52 | C5.2 R50.2 36.23,43.11 36.5,42.84 | 36.5,42.84 36.5,21.18 C54.2
  Bottom 0.254: TFT-18PIN1.P$9 TFT-18PIN1.P$10
  Bottom 0.5: v12.09,31.71 9.76,31.71 v9.73,31.73 | v26.82,44.81 27.82,43.82 28.96,43.82 | 25.86,29.4 22.55,29.4 22.55,29.39 21.09,29.39 v21.05,29.43 | J1.P$6 26.97,15.02 v26.62,14.67 27.13,14.16 29.41,14.16 J1.P$5
AGND  (2 unrouted)
  Top 0.254: 81.99,2.22 81.23,2.22 | 81.84,6.43 U2.7 | 83.77,5.16 U2.1 86.41,5.11 | 91.29,4.51 C53.2 | C55.1 77.29,8.52 77.24,8.57 77.24,10.03 R30.1
  Top 0.36: C46.1 79.9,13.46 | 77.35,10.9 R30.1
  Top 0.5: C12.1 75.83,2.97 76.58,2.22 81.23,2.22 83.01,2.22 83.77,2.98 83.77,5.16 | 83.77,5.16 83.77,6.03 83.37,6.43 U2.7 | 83.77,5.16 83.81,5.11 86.41,5.11 | U2.1 86.92,5.16 88.59,3.49 90.63,3.49 91.29,4.16 91.29,4.51 | C53.2 92.14,4.75 92.76,5.38 92.76,10.5 91.73,11.53 91.54,11.53 91.54,11.54 88.76,11.54 87.32,12.98 87.32,14.41 86.76,14.98 C51.1 86,16.25 85.25,17 82.28,17 81.64,16.35 80.72,15.43 80.72,14.2 81.46,13.46 C46.1 78.75,13.46 77.24,11.95 77.24,8.57
BAT+  (2 unrouted)
  Top 0.5: 5.45,25.76 5.45,26.26 5.33,26.14
  Top 0.8: Q3.3 8.89,8.09 8.89,11.73 11.5,14.33 D5.A 11.66,14.59 11.92,14.59 | U26.3 5.2,27.69
  Top 1: 11.5,14.33 12.09,14.92 12.09,17.27 10.51,18.85 J5.P$1 5.16,21.65 C48.2 C47.2 | 5.2,27.69 5.2,25.76
BYPASS_IN+
  Top 0.254: C53.1 88.86,4.75 87.18,6.43 U2.2 U2.3
D+
  Top 0.3: R9.1 11.46,41.07 J3.B6 7.14,41.07 6.82,41.38 6.82,41.71 7.18,42.07 J3.A6
D-
  Top 0.3: J3.B7 9.9,42.57 9.9,42.56 | 9.9,42.56 11.56,42.56 R8.1 | J3.A7 9.46,41.57 9.9,42.01 9.9,42.56
DTR  (via drill 0.35)  (1 unrouted)
  Top 0.3: U6.13 20.42,40.63 19.76,41.3 18.89,41.3 v18.64,41.55 | 12.34,49.7 11.83,49.19 v11.83,48.77 11.83,48.01 R75.2
  Bottom 0.3: v18.64,41.55 18.64,41.8 11.83,48.61 v11.83,48.77
EN_RESET  (via drill 0.35)  (2 unrouted)
  Top 0.254: 26.11,49.73 R4.2 26.02,48.21 v25.96,48.14 | U24.3 91.43,37.83 87.07,33.46 v86.05,33.46 | 26.11,53.36 25.26,54.21 25.09,54.38 | v27.49,50.5 27,50.99 26.02,50.99
  Top 0.3: 25.09,54.38 24.76,54.38 | 25.3,55.07 K4.2 22.87,52.64 15.87,52.64 15.06,51.84 Q9.3 | v25.86,40.49 25.35,39.99 25.35,38.27 24.27,37.18 23.51,37.18 22.92,36.59 R46.2
  Top 0.5: R4.2 26.02,50.99 26.02,53.45 25.26,54.21
  Bottom 0.254: v25.86,40.5 v25.86,40.49 25.79,40.56 25.79,47.97 v25.96,48.14 | v86.05,33.46 85.8,33.72 56.08,33.72
  Bottom 0.3: v27.49,50.5 27.75,50.75 39.05,50.75 56.08,33.72
GND  (via drill 0.35, 3.2 pad 5.2)
  Top 0.3: U24.15 75.86,38.27 U24.15@1
  Top 0.5: J3.A1 8.2,45.8 7.71,46.3 7.1,46.3 J3.P$6
  Top 1: J3.P$7 J3.P$9 | U24.1 93.97,37.58 | U24.1 93.97,40.28 | U24.38 93.97,22.75 93.17,23.56 93.17,23 93.97,22.19 U24.38 | U24.38 | U24.38 93.97,17.25 | U24.1 93.89,38.68 93.89,42.55
  other vias: 72.52,43.46 87.58,17.45 69.26,57.34 89.69,56.71 46.27,47.65 34.24,2.86 20.4,8.56 50.24,47.7 8.94,46.02 51.05,18.71 29.21,2.78 18.68,2.25 14.26,2.23 53.26,14.95 9.46,34.4 92.63,12.56 48.73,2.75 8.96,52.61 12.72,52.13 55.1,15.61 8.86,4.17 49.14,57.35 16.21,2.31 9.08,48.26 39.61,2.65 12.53,34.39 12.5,36.56 67.98,43.36 86.28,2.66 84.7,49.35 43.64,3.32 11.99,12.63 16.06,6.64 31.71,2.79 59.44,2.79 53.96,47.83 3.56,3.56 3.56,56.08 49.7,24.78 92.53,15.58 90.82,40.82 59.91,24.49 80.73,40.93 85.4,24.69 87.65,40.69 86.51,23.74 85.42,22.96 92.47,36.38 92.58,25.69 72.93,16.3 79.05,40.85 86.04,40.47 87.55,24.62 70.07,15.91 87.79,26.75 74.95,44.56 63.86,49.08 85.32,26.84 92.57,33.57 31.9,13.96 91.36,19.1 92.57,29.92 77.44,18.67 86.61,19.29 51.67,41.34 24.45,22.16 37.86,24.68 31.98,26.31 41.6,24.62 27.12,37.08 19.87,37.66 18.6,37.66 8.61,36.55 9.4,27.36 8.69,33.68 9.28,32.74 9.32,37.59 12.65,32.95 8.81,13.3 8.82,15.57 10.34,16.17 8.79,14.56 19.28,9.34 54.48,24.58 45.62,24.63 41.06,13.9 42.32,12.69 24.28,46.22 19.46,51.3 19.38,49.84 9.8,54.77 44.35,49.26 63.91,43.42 58.88,56.21 38.45,56.14 18.24,3.07 20.02,3.07 20.78,6.37 10.28,17.22 9.06,20.49 9.52,25.54 8.68,35.22 12.85,45.17 8.86,47.29 10.13,44.24 10.13,45.51 9.88,46.53 12.47,38.27 92.63,14.09 92.58,23.15 86.6,25.6 54.06,2.5 31.63,4.75 41.46,4.26 54.31,4.46 19.06,54.87 24.53,52.45 43.84,52.06 63.87,52.4 82.67,52.4 91.56,47.32 91.56,53.67 92.48,45.03 88.51,47.32 84.45,47.32 91.56,50.37 87.5,52.91 34.85,18.86 35.87,18.86 13.13,22.77 15.59,20.48 9.51,35.84 38.74,40.63 65.84,20.64 68.63,23.43 69.08,24.64 67.53,15.4 98.06,3.58 98.04,56.06 27.11,32.66 27.11,28.21 17.03,12.13 15.98,7.9 14.63,37.78 37.48,13.33 75.78,41.39 61.76,43.33 92.67,28.09 92.65,48.52 90.19,48.87 25.96,21.74 26.55,19.06 19.55,27.96
  pour Bottom: 8.08,57.85 93.42,57.85 93.42,1.71 8.08,1.71
  pour Top: -1.52,60.95 99.87,60.95 102.3,58.52 102.3,53.14 94.49,53.14 94.49,6.44 102.3,6.44 102.3,-2.63 102.05,-2.89 -1.52,-2.89
IN-
  Top 0.254: R22.2 89.77,8.79 R37.1 86.52,8.81 U2.4
IO0_BOOT  (via drill 0.35)
  Top 0.254: U24.25 77.81,21.35 v77.81,32.47 | v33.01,49.48 33.01,51.49 27.52,56.98 17.57,56.98 15.47,54.88 K1.2
  Top 0.3: Q10.3 14.04,54.88 15.47,54.88
  Bottom 0.254: v77.81,32.47 55.05,32.47 38.04,49.48 v33.01,49.48
IO2_TFT_RS  (via drill 0.35)
  Top 0.254: 73.59,17.04 73.01,17.04 52.69,17.04 v52.27,17.46
  Top 0.3: 73.59,17.04 76.19,19.64 U24.24@1 76.19,23.75 U24.24
  Bottom 0.254: TFT-18PIN1.P$4 24.73,25.43 20.45,25.43 19.86,24.84 19.86,21.87 24.32,17.41 J1.P$9 29.6,17.54 52.19,17.54 v52.27,17.46
IO5_TF_CS
  Top 0.254: 82.58,20.03 82.58,20.96 U24.29
  Top 0.3: 82.58,20.03 81.96,19.42 80.51,19.42 75.05,13.96 45.83,13.96 44.93,14.85 SD1.2 44.93,17.72 44.67,17.99 R67.2
IO12_TFT_SDO/TP_OUT  (via drill 0.35)
  Top 0.254: v80.09,27.12 80.09,34.6 77.46,37.23 U24.14 77.46,42.84 R40.1 | U3.15 19.56,16.12 v19.58,16.12
  Bottom 0.254: v80.09,27.12 74.04,27.12 56.85,9.92 26.09,9.92 19.74,16.28 v19.58,16.12
IO13_TFT_SDI/TP_DIN  (via drill 0.35)
  Top 0.254: U3.14 18.92,23.68 18.92,25.22 | v19.34,26.83 18.92,26.41 18.92,25.22 | 18.92,25.22 | U24.16 74.85,34.24 | 69.9,39.56 69.9,26.73 65.21,22.03 v47.7,22.03 47.65,21.98 R39.1
  Top 0.3: 74.85,34.24 74.41,34.68 74.41,37.1 74.93,37.61 U24.16@1 74.92,38.61 74.92,39.87 74.41,40.37 70.72,40.37 69.9,39.56
  Bottom 0.254: v19.34,26.83 19.52,27.01 TFT-18PIN1.P$6 26.72,27.01 27.13,26.61 27.13,20.26 27.63,19.75 29.41,19.75 J1.P$12 29.47,19.8 45.46,19.8 v47.7,22.03
IO14_TFT_CLK/TP_CLK  (via drill 0.35)  (1 unrouted)
  Top 0.254: U3.16 20.2,22.9 20.78,22.33 v20.78,22.29 | U24.13 78.73,36.82 81.01,34.54 v81.01,28.3 | R34.1 49.15,21.01 v62.43,21.01
  Bottom 0.254: TFT-18PIN1.P$3 21.29,24.61 20.78,24.1 v20.78,22.29 24.84,18.22 28.9,18.22 | J1.P$10 29.59,18.08 46.25,18.08 49.18,21.01 v62.43,21.01 63.95,21.01 71.24,28.3 v81.01,28.3
IO15_TFT_CS  (via drill 0.35)  (1 unrouted)
  Top 0.254: 67.85,18.06 67.44,18.06 | 67.44,18.06 54.14,18.06 v53.97,18.23 | U24.23 75.14,25.35 | 67.44,18.06 73.27,18.06
  Top 0.3: U24.23 75.01,25.35 74.41,24.75 74.41,22.31 74.93,21.8 U24.23@1 74.93,19.72 73.27,18.06
  Bottom 0.254: TFT-18PIN1.P$5 20.38,26.21 19.25,25.08 19.25,21.53 24.17,16.61 J1.P$8 29.47,16.6 53.1,16.6 53.97,17.47 v53.97,18.23
  Bottom 0.3: 29.06,16.51 28.96,16.62
IO18_TF_SPI_CLK
  Top 0.254: 83.85,20.03 83.85,20.96 U24.30
  Top 0.3: SD1.5 41.59,15.44 41.59,14.54 43.96,12.17 74.46,12.17 80.86,18.57 82.39,18.57 83.85,20.03
IO19_TF_SPI_MISO  (1 unrouted)
  Top 0.254: R24.2 39.91,18.06 39.43,17.57 SD1.7
  Top 0.3: SD1.7 39.43,14.32 42.16,11.59 74.87,11.59 81.31,18.03 83.65,18.03 85.16,19.54 85.16,21.33
IO21_SCL  (via drill 0.35)
  Top 0.254: U24.33 87.62,23.35 89.38,25.11 89.38,33.24 v89.63,33.49 | J6.1 55.83,50.17 v55.83,44.89 55.86,44.86 R26.1
  Bottom 0.254: v89.63,33.49 89.58,33.49 88.47,34.61 60.53,34.61 55.83,39.31 v55.83,44.89
IO22_SDA  (via drill 0.35)  (1 unrouted)
  Top 0.254: 57.86,50.48 v57.86,44.89 57.86,43.87 R27.1
  Top 0.3: v90.67,34.74 91.6,33.81 91.6,21.17 U24.36
  Bottom 0.254: v90.67,34.74 90.62,34.74 89.85,35.51 61.15,35.51 57.86,38.8 v57.86,44.89
IO23_TF_SPI_MOSI  (via drill 0.35)  (1 unrouted)
  Top 0.3: R23.2 43.32,18.28 43.83,17.77 SD1.3 43.83,14.07 44.76,13.14 v72.91,13.14 | v91.91,17.33 92.67,18.09 92.67,20.8
  Bottom 0.3: v72.91,13.14 84.9,13.14 89.09,17.33 v91.91,17.33
IO25_PROT_A/D  (via drill 0.35)
  Top 0.254: U24.10 82.54,41.34 v82.03,41.85 82.03,43 R18.1 | v75.89,48.2 75.89,50.15 J7.1
  Bottom 0.254: v82.03,41.85 82.03,42.1 75.94,48.2 v75.89,48.2
IO26_SPEAK  (via drill 0.35)
  Top 0.254: U24.11 81.53,38.35 81.53,37.27
  Top 0.3: v83.29,16.01 83.32,15.99 R12.1 | v82.57,23.02 82.58,23.03 82.58,36.22 81.53,37.27
  Bottom 0.3: v83.29,16.01 82.56,16.75 82.56,23.01 v82.57,23.02
IO27_LCD_BLK_CTR  (via drill 0.35)
  Top 0.254: U24.12 80,36.47 81.12,35.35 81.12,35.34 81.74,34.73 81.74,29.5 v81.81,29.5 | v32.48,21.96 32.48,22.93 R38.1 Q6.1
  Bottom 0.254: v81.81,29.5 70.4,29.5 63.79,22.88 33.4,22.88 v32.48,21.96
IO32_PROT_A/D  (via drill 0.35)  (1 unrouted)
  Top 0.254: U24.8 85.08,40.46 v83.6,41.94 83.51,42.02 R25.1 | v77.93,48.2 77.93,49.47
  Bottom 0.254: v77.93,48.2 77.93,47.61 v83.6,41.94
IO33_TP_CS  (via drill 0.35)
  Top 0.254: U24.9 83.81,37.07 83.48,36.73 v83.48,27.6 | U3.12 v17.66,18.04
  Bottom 0.254: v17.66,18.04 17.66,16.35 24.98,9.03 57.13,9.03 74.01,25.92 81.8,25.92 v83.48,27.6
IO36_TP_IRQ  (via drill 0.35)
  Top 0.254: R10.1 16.44,26.2 17.02,25.29 U3.11 17.03,19.72 v16.55,19.24 | U24.4 90.16,37.84 87.88,35.55 86.86,35.55 84.37,33.06 v84.37,25.64
  Bottom 0.254: v84.37,25.64 83.53,24.8 74.6,24.8 57.89,8.1 24.3,8.1 16.46,15.93 16.46,19.15 v16.55,19.24
LEDK
  Top 0.5: Q6.3 33.44,27.39 R2.2 32.52,29.53 R7.2 32.5,29.59 R11.1 32.5,32.29 R28.1 R29.1 R32.1 R33.1
LEDK1  (via drill 0.5)  (2 unrouted)
  Top 0.5: R2.1 29.29,28 26.28,31.01 23.06,31.01 v22.39,31.68
  Bottom 0.254: TFT-18PIN1.P$11 24.73,30.99
  Bottom 0.5: TFT-18PIN1.P$14 TFT-18PIN1.P$11 | 24.73,30.99 23.08,30.99 v22.39,31.68
N$1
  Top 0.5: R3.1 LED1.+
N$2
  Top 0.3: R75.1 13.2,49.44 Q9.1
N$3
  Top 0.254: 82.05,14.98 R12.2 R19.1
  Top 0.36: 82.05,14.98 81.97,14.91 C46.2
N$4
  Top 0.254: R41.2 14.71,28.13 15.64,28.13 16.39,28.88 U3.7
N$5  (via drill 0.35)  (16 unrouted)
  Top 0.5: R44.2 30.85,37.67 28.94,35.75 v27.41,35.75
  Bottom 0.5: v27.41,35.75 27.5,35.83 29.41,35.83 J1.P$32 J1.P$15
N$6
  Top 0.3: J3.B5 11.42,40.07 R14.1
N$7
  Top 0.3: J3.A5 10.82,43.07 R13.2
N$8  (via drill 0.35)
  Top 0.254: R11.2 35.18,30.93 v35.28,30.84
  Bottom 0.254: J1.P$44 29.46,45.41 31.5,45.41 32.82,44.08 32.82,33.29 v35.28,30.84
N$9  (via drill 0.35)
  Top 0.254: v31.7,18.99 33.56,18.99 P2.P$1
  Bottom 0.254: J1.P$11 31.68,19.01 v31.7,18.99
N$10
  Top 0.3: U24.17 74.43,32.97 73.49,33.91 73.49,38.43 U24.17@1
N$11
  Top 0.3: U24.18 74.1,31.7 72.39,33.41 U24.18@1
N$12  (via drill 0.35)
  Top 0.254: R7.1 v35.27,29.57 v35.28,29.57
  Bottom 0.254: J1.P$43 29.46,44.61 31.28,44.61 32.06,43.83 32.06,32.79 v35.28,29.57
N$13
  Top 0.8: U1.3 20.11,4.97 22.17,2.91 24.47,2.91 L4.1
N$14  (via drill 0.35)
  Top 0.254: R35.1 27.74,40.48 v26.74,41.47
  Bottom 0.254: v26.74,41.47 26.84,41.38 J1.P$39
N$15
  Top 0.3: U24.19 72.43,30.43 70.97,31.89 70.97,38.45 U24.19@1
N$16  (via drill 0.35)
  Top 0.254: R36.1 27.84,41.78 v27.34,42.28
  Bottom 0.254: J1.P$40 27.44,42.18 v27.34,42.28
N$17  (via drill 0.35)
  Top 0.254: R50.1 26.82,43.11 v26.77,43.06
  Bottom 0.3: v26.77,43.06 29.4,43.06 J1.P$41
N$18  (via drill 0.35)
  Top 0.254: v31.82,15.82 33.09,15.82 33.91,14.99 P1.P$1
  Bottom 0.254: J1.P$7 v31.82,15.82
N$19
  Top 0.3: U24.20 75.74,29.03 72.23,29.03 71.12,27.92 U24.20@1
N$20
  Top 0.5: U1.5 18.28,7.62 18.28,10.84 R21.1 R20.2
N$21
  Top 1: R1.2 R45.1 12.45,4.61 Q3.1
N$22
  Top 0.3: U26.5 8.74,30.2 R5.1
N$23
  Top 0.3: U24.21 73.86,27.89 72.39,26.42 U24.21@1
N$24
  Top 0.3: U24.22 74.85,26.62 73.49,25.25 73.49,21.19 U24.22@1
N$26
  Top 0.254: C51.2 86,13.2 88.51,10.69 91.56,10.69 92.15,10.1 92.15,7.08 C14.1
  Top 0.5: C51.2 R19.2
N$29
  Top 0.3: C14.2 R22.1
N$32  (via drill 0.35)
  Top 0.254: R28.2 34.1,32.36 v35.02,32.36
  Bottom 0.254: J1.P$45 31.62,46.2 33.36,44.46 33.36,33.97 34.97,32.36 v35.02,32.36
N$33  (via drill 0.35)
  Top 0.254: v35.28,33.38 34.28,33.38 R29.2
  Bottom 0.254: J1.P$46 31.65,47 33.94,44.71 33.94,34.82 35.28,33.48 v35.28,33.38
N$34  (via drill 0.35)  (1 unrouted)
  Top 0.254: R32.2 34.95,34.97 v35.02,34.9
  Bottom 0.254: J1.P$47 31.88,47.8 34.52,45.16 34.52,35.41 v35.02,34.9
  Bottom 0.5: 28.96,47.83 28.96,47.82
N$35  (via drill 0.35)
  Top 0.254: R33.2 35.11,36.34 v35.28,36.51
  Bottom 0.254: J1.P$48 31.92,48.6 35.28,45.24 v35.28,36.51
N$38
  Top 0.3: R74.1 11.59,46.51 11.09,46.51 10.04,47.56 Q10.1
N$40  (via drill 0.35)
  Top 0.254: U6.2 v22.96,43.38 v22.97,43.37 | v89.1,12.89 v89.09,12.9 R72.2
  Bottom 0.254: v22.97,43.37 22.89,43.37 14.67,35.15 14.67,16.29 24.04,6.92 66.24,6.92 67.93,8.61 84.82,8.61 v89.1,12.89
N$42  (via drill 0.35)
  Top 0.254: U6.3 21.69,43.38 v21.71,43.37 | v90.37,12.89 90.35,12.91 R71.2
  Bottom 0.254: v21.71,43.37 21.71,43.03 14.17,35.5 14.17,16.04 23.97,6.24 66.5,6.24 68.36,8.1 85.58,8.1 v90.37,12.89
N$47
  Top 0.3: R16.2 46.03,18.87 SD1.1
N$48
  Top 0.3: R17.2 38.33,18.67 SD1.8
RTS  (via drill 0.35)
  Top 0.3: U6.14 21.69,40.68 19.81,42.56 v19.56,42.56 | R74.2 13.77,46.42 14.61,47.26 v14.61,48.61 14.69,48.61 15.47,49.38 Q9.2
  Bottom 0.3: v19.56,42.56 14.61,47.51 v14.61,48.61
TFT_RESET  (via drill 0.35)
  Top 0.5: v22.59,23.74 22.59,29.37 20.99,30.97 20.99,34.15 R47.1 R46.1 C23.1 24.56,34.28 25.95,35.66 25.95,37.35 26.87,38.27 v26.87,39.45
  Bottom 0.5: TFT-18PIN1.P$2 22.65,23.81 v22.59,23.74 | v26.87,39.45 26.7,39.62 26.7,39.95 27.33,40.58 J1.P$38
TP_X+  (via drill 0.35)
  Top 0.254: v19.77,31.03 19.56,30.83 U3.2 19.56,30.78 20.07,31.29 20.07,34.23 C21.2
  Bottom 0.254: J1.P$4 26.34,13.42 18.5,21.26 18.5,29.76 v19.77,31.03 19.8,31.03 22.99,34.23 24.74,34.23 TFT-18PIN1.P$15
TP_X-  (via drill 0.35)
  Top 0.254: U3.4 18.3,31.25 17.38,32.16 v17.38,32.18 17.13,32.43 C19.2
  Bottom 0.254: J1.P$2 26.32,11.81 16.53,21.61 16.53,31.33 v17.38,32.18 18.47,32.18 22.1,35.81 TFT-18PIN1.P$17
TP_Y+  (via drill 0.35)  (1 unrouted)
  Top 0.254: U3.3 18.93,32.86 v18.37,33.41 18.37,33.92 18.5,34.05
  Bottom 0.254: J1.P$1 26.36,11.01 15.9,21.47 15.9,31.95 17.36,33.41 v18.37,33.41 18.37,33.86 21.12,36.6 24.74,36.6 TFT-18PIN1.P$18
TP_Y-  (via drill 0.35)
  Top 0.254: v17.51,30.84 17.66,30.69 U3.5 17.66,30.74 15.81,32.59 C18.2
  Bottom 0.254: J1.P$3 26.38,12.62 17.51,21.49 v17.51,30.84 18.17,30.84 22.33,35.01 TFT-18PIN1.P$16
UART0_RXD0  (via drill 0.35)
  Top 0.254: R72.1 88.89,15.93 U24.34
  Top 0.3: J10.1 35.76,48.45 v35.86,48.35 | v90.12,29.62 90.07,29.57 90.07,24.02 88.89,22.85 U24.34
  Bottom 0.3: v35.86,48.35 53.58,30.63 89.11,30.63 v90.12,29.62
UART0_TXD0  (via drill 0.35)  (1 unrouted)
  Top 0.254: R71.1 90.16,15.92 90.16,21.27 | v90.82,30.93 90.99,30.77 90.99,22.62 90.23,21.86 90.23,21.68 | v37.81,48.23 37.81,50.07 J10.2
  Top 0.3: U24.35 90.16,21.27 | v37.81,48.23 37.85,48.27
  Bottom 0.254: v90.82,30.93 90.32,31.44 54.6,31.44 v37.81,48.23
USB_D+
  Top 0.3: U6.5 19.02,44.52 19.02,43.55 16.97,41.51 13.42,41.51 R9.2
USB_D-
  Top 0.3: U6.6 18.11,44.43 18.11,43.63 16.65,42.17 13.48,42.17 R8.2
VBUS  (via drill 0.35)  (6 unrouted)
  Top 0.5: D3.1 14.7,14.1 | R45.2 10.06,4.42 v8.98,5.51 | v13.77,12.32 13.77,13.58 14.94,14.75
  Top 0.65: 10.86,37.92 9.38,39.41 8.15,39.41 | 7.93,39.41 7.06,39.41 | 7.85,44.2 7.01,44.2
  Top 0.7: 7.06,39.41 5.88,40.58 5.88,43.08 7.01,44.2
  Top 1: D3.1 15.6,16.75 10.86,21.48 10.86,22.23 | 10.86,37.92 10.86,22.23 | U26.4 6.96,27.93 C50.1 7,26.14 C49.2 7,22.87 7.72,22.15 10.78,22.15 10.86,22.23
  Bottom 0.5: v8.98,5.51 8.98,7.53 v13.77,12.32
VIN  (1 unrouted)
  Top 0.152: C6.2 16.44,4.97 U1.1
  Top 0.203: 16.32,5.17 C6.2
  Top 0.5: U1.4 18.03,5.47 U1.1
  Top 0.8: U1.1 17.7,5.3 | 15.7,10.22 15.54,10.38 D5.C 12.45,9.43 Q3.2
  Top 1: 17.7,5.3 C42.2 14.55,9.99 D3.2
VO1  (via drill 0.5)
  Top 0.254: v80.97,10.1 81.02,10.05
  Top 0.5: R37.2 90.02,10.1 v80.97,10.1 | 81.02,10.05 U2.5 | v70.31,10.35 65.31,10.35 64.84,9.88 64.84,8.14 J8.P$1
  Bottom 0.254: 80.95,10.12 v80.97,10.1
  Bottom 0.5: 80.95,10.12 70.54,10.12 v70.31,10.35
VO2  (via drill 0.5)  (1 unrouted)
  Top 0.254: 79.5,5.16 v79.7,5.16
  Top 0.3: 66.71,7.84 66.71,7.23
  Top 0.5: v68.98,6.23 68.9,6.31 67.63,6.31 66.71,7.23 | U2.8 v79.7,5.16
  Bottom 0.5: v79.7,5.16 70.05,5.16 v68.98,6.23

### Text on the board
tPlace: IO3_RXD | IO1_TXD | 3V3 | GND | IO21_SCL | IO22_SDA | 3V3 | GND | IO25 | IO32 | 3V3 | GND | V2.1
tNames: + | R71 | - | VON- | VOP+ | IO26-SPK
tStop: ESP32 Display-3.5 inch | SKU:DIS05035H